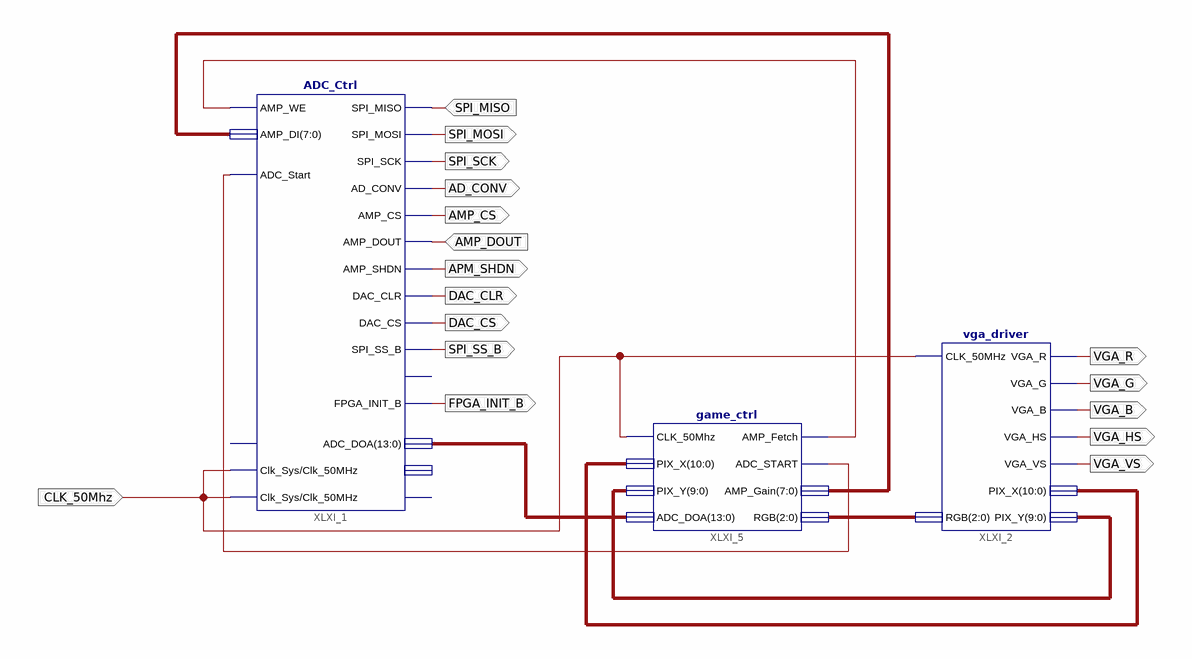
[diagram p0: schematic sheet 1]
// Xilinx ISE schematic game.sch (spartan3e) as structural Verilog: 3 symbols, 17 ports
module game (
  input  CLK_50Mhz,
  input  SPI_MISO,
  input  AMP_DOUT,
  output SPI_MOSI,
  output SPI_SCK,
  output AMP_CS,
  output APM_SHDN,
  output AD_CONV,
  output DAC_CS,
  output DAC_CLR,
  output SPI_SS_B,
  output FPGA_INIT_B,
  output VGA_VS,
  output VGA_HS,
  output VGA_B,
  output VGA_G,
  output VGA_R
);

  wire XLXN_38, XLXN_39;
  wire [2:0] XLXN_36;
  wire [7:0] XLXN_40;
  wire [9:0] XLXN_35;
  wire [10:0] XLXN_34;
  wire [13:0] XLXN_37;

  ADC_Ctrl XLXI_1 (
    .Clk_Sys(CLK_50Mhz), .AMP_WE(XLXN_38), .ADC_Start(XLXN_39), .SPI_MISO(SPI_MISO), .AMP_DOUT(AMP_DOUT),
    .AMP_DI(XLXN_40), .SPI_MOSI(SPI_MOSI), .SPI_SCK(SPI_SCK), .AMP_CS(AMP_CS), .AMP_SHDN(APM_SHDN),
    .AD_CONV(AD_CONV), .DAC_CS(DAC_CS), .DAC_CLR(DAC_CLR), .SPI_SS_B(SPI_SS_B), .FPGA_INIT_B(FPGA_INIT_B),
    .ADC_DOA(XLXN_37), .Clk_50MHz(CLK_50Mhz));  // open: Busy, SF_CE0, ADC_DOB, Reset
  game_ctrl XLXI_5 (
    .CLK_50Mhz(CLK_50Mhz), .PIX_X(XLXN_34), .PIX_Y(XLXN_35), .ADC_DOA(XLXN_37), .AMP_Fetch(XLXN_38),
    .ADC_START(XLXN_39), .AMP_Gain(XLXN_40), .RGB(XLXN_36));
  vga_driver XLXI_2 (
    .CLK_50MHz(CLK_50Mhz), .RGB(XLXN_36), .VGA_R(VGA_R), .VGA_G(VGA_G), .VGA_B(VGA_B), .VGA_HS(VGA_HS),
    .VGA_VS(VGA_VS), .PIX_X(XLXN_34), .PIX_Y(XLXN_35));
endmodule
